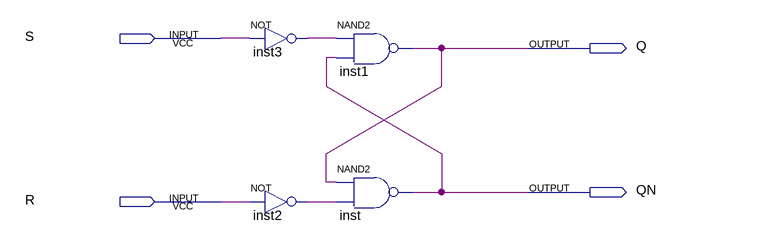
[diagram p0: schematic sheet]
// Quartus schematic lab9step1b.bdf as structural Verilog: 4 symbols, 4 pins
module lab9step1b (
  input  S,
  input  R,
  output Q,
  output QN
);

  wire inst2_out, inst3_out;

  not inst3 (inst3_out, S);
  not inst2 (inst2_out, R);
  nand inst1 (Q, inst3_out, QN);
  nand inst (QN, Q, inst2_out);
endmodule
